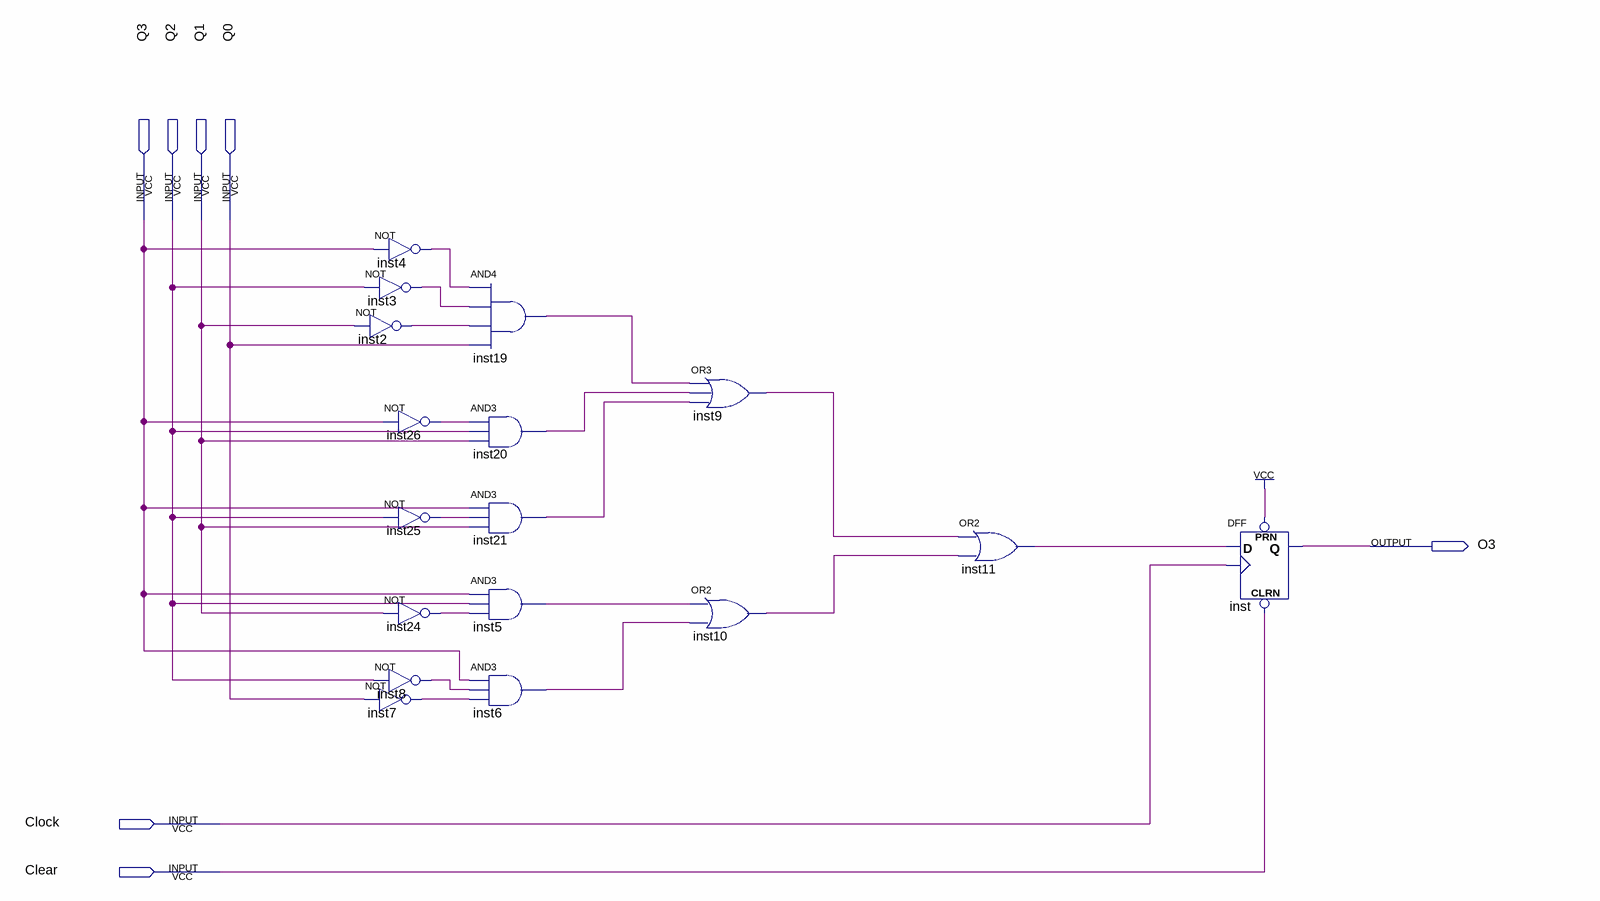
[diagram p0: schematic sheet]
// Quartus schematic D3.bdf as structural Verilog: 17 symbols, 7 pins
module D3 (
  input  Q3,
  input  Q2,
  input  Q1,
  input  Q0,
  input  Clock,
  input  Clear,
  output O3
);

  wire inst2_out, inst3_out, inst4_out, inst5_out, inst6_out, inst7_out, inst8_out, inst9_out, inst10_out,
       inst11_out, inst19_out, inst20_out, inst21_out, inst24_out, inst25_out, inst26_out;

  not inst4 (inst4_out, Q3);
  not inst3 (inst3_out, Q2);
  not inst2 (inst2_out, Q1);
  not inst26 (inst26_out, Q3);
  not inst25 (inst25_out, Q2);
  not inst24 (inst24_out, Q1);
  not inst8 (inst8_out, Q2);
  not inst7 (inst7_out, Q0);
  and inst19 (inst19_out, inst4_out, inst3_out, inst2_out, Q0);
  and inst20 (inst20_out, inst26_out, Q2, Q1);
  and inst21 (inst21_out, Q3, inst25_out, Q1);
  and inst5 (inst5_out, Q3, Q2, inst24_out);
  and inst6 (inst6_out, Q3, inst8_out, inst7_out);
  or inst9 (inst9_out, inst19_out, inst20_out, inst21_out);
  or inst10 (inst10_out, inst5_out, inst6_out);
  or inst11 (inst11_out, inst9_out, inst10_out);
  DFF inst (.CLRN(Clear), .CLK(Clock), .D(inst11_out), .PRN(1'b1), .Q(O3));
endmodule
